# EAGLE design Lin_Termo (EAGLE 7.7.0)
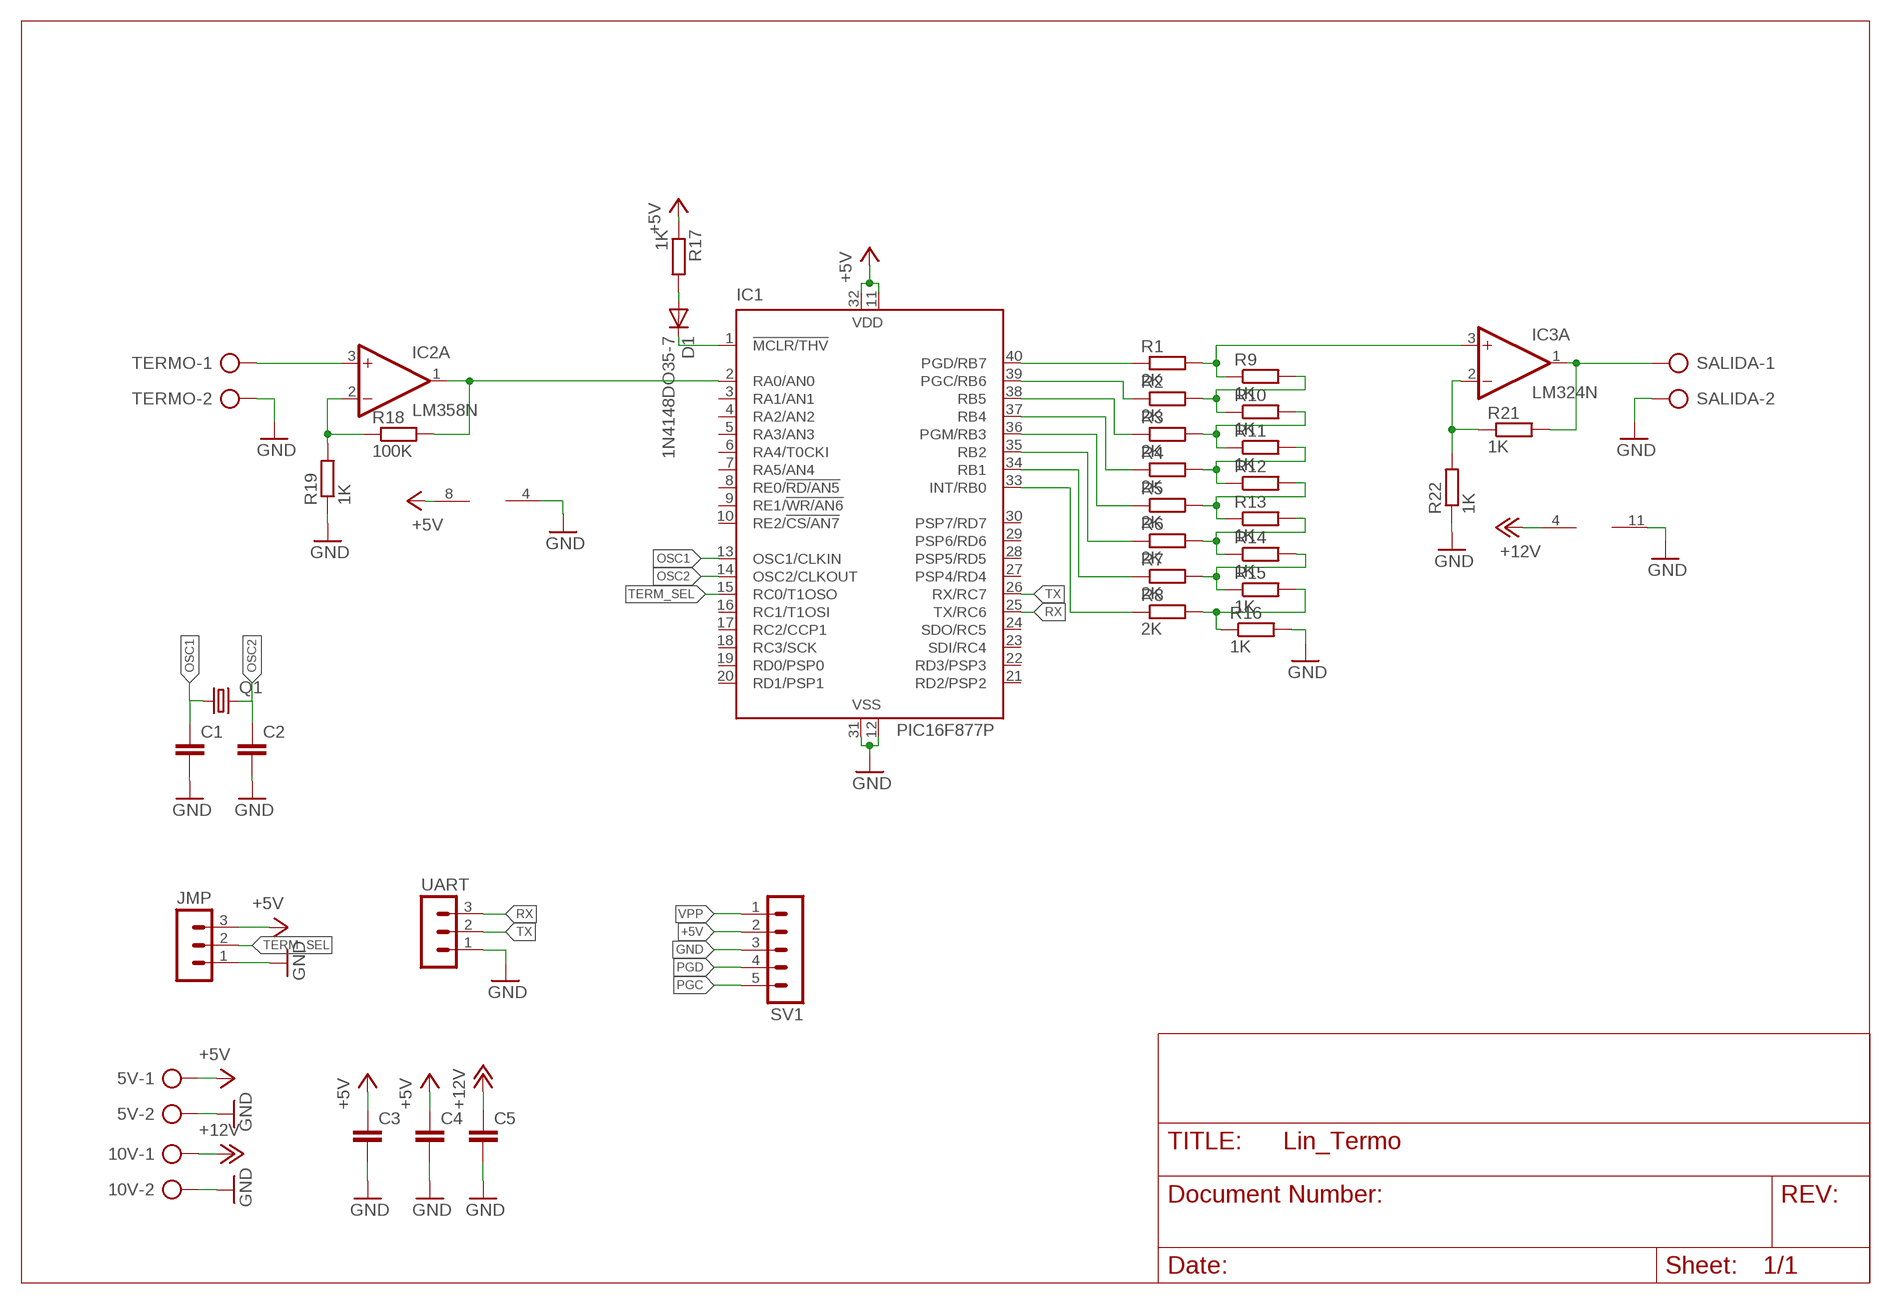
[diagram p0: schematic, sheet 1]

## Parts
5V  AK500/2  [AK500/2]
10V  AK500/2  [AK500/2]
C1  C-EU025-025X050  [C025-025X050]
C2  C-EU025-025X050  [C025-025X050]
C3  C-EU025-025X050  [C025-025X050]
C4  C-EU025-025X050  [C025-025X050]
C5  C-EU025-025X050  [C025-025X050]
D1  1N4148DO35-7  [DO35-7]
IC1  PIC16F877P  [DIL40]
IC2  LM358N  [DIL08]
IC3  LM324N  [DIL14]
JMP  MA03-1  [MA03-1]
Q1  CRYSTALHC49S  [HC49/S]
R1  2K  R-EU_0207/2V  [0207/2V]
R2  2K  R-EU_0207/2V  [0207/2V]
R3  2K  R-EU_0207/2V  [0207/2V]
R4  2K  R-EU_0207/2V  [0207/2V]
R5  2K  R-EU_0207/2V  [0207/2V]
R6  2K  R-EU_0207/2V  [0207/2V]
R7  2K  R-EU_0207/2V  [0207/2V]
R8  2K  R-EU_0207/2V  [0207/2V]
R9  1K  R-EU_0207/2V  [0207/2V]
R10  1K  R-EU_0207/2V  [0207/2V]
R11  1K  R-EU_0207/2V  [0207/2V]
R12  R-EU_0207/2V  [0207/2V]
R13  1K  R-EU_0207/2V  [0207/2V]
R14  1K  R-EU_0207/2V  [0207/2V]
R15  1K  R-EU_0207/2V  [0207/2V]
R16  1K  R-EU_0207/2V  [0207/2V]
R17  1K  R-EU_0207/7  [0207/7]
R18  100K  R-EU_0207/7  [0207/7]
R19  1K  R-EU_0207/7  [0207/7]
R21  1K  R-EU_0207/7  [0207/7]
R22  1K  R-EU_0207/7  [0207/7]
SALIDA  AK500/2  [AK500/2]
SV1  MA05-1  [MA05-1]
TERMO  AK500/2  [AK500/2]
UART  MA03-1  [MA03-1]

## Nets
+5V: 5V.1 C3.1 C4.1 IC1.11(VDD) IC1.32(VDD) IC2.8(P:V+) JMP.3 R17.1 SV1.2
+12V: 10V.1 C5.1 IC3.4(P:V+)
GND: 5V.2 10V.2 C1.2 C2.2 C3.2 C4.2 C5.2 IC1.12(VSS) IC1.31(VSS) IC2.4(P:V-) IC3.11(P:V-) JMP.1 R16.2 R19.1 R22.1 SALIDA.2 SV1.3 TERMO.2 UART.1
N$1: IC3.3(A:+IN) R1.2 R9.1
N$2: R2.2 R9.2 R10.1
N$3: R3.2 R10.2 R11.1
N$4: R4.2 R11.2 R12.1
N$5: R5.2 R12.2 R13.1
N$6: R6.2 R13.2 R14.1
N$7: R7.2 R14.2 R15.1
N$10: D1.A R17.2
N$12: IC1.38(RB5) R3.1
N$13: IC1.37(RB4) R4.1
N$14: IC1.36(PGM/RB3) R5.1
N$15: IC1.35(RB2) R6.1
N$16: IC1.34(RB1) R7.1
N$17: IC1.33(INT/RB0) R8.1
N$18: IC1.2(RA0/AN0) IC2.1(A:OUT) R18.2
N$20: IC2.2(A:-IN) R18.1 R19.2
N$21: IC2.3(A:+IN) TERMO.1
N$22: R8.2 R15.2 R16.1
N$26: IC3.2(A:-IN) R21.1 R22.2
N$27: IC3.1(A:OUT) R21.2 SALIDA.1
OSC1: C1.1 IC1.13(OSC1/CLKIN) Q1.1
OSC2: C2.1 IC1.14(OSC2/CLKOUT) Q1.2
PGC: IC1.39(PGC/RB6) R2.1 SV1.5
PGD: IC1.40(PGD/RB7) R1.1 SV1.4
RX: IC1.25(TX/RC6) UART.3
TERM_SEL: IC1.15(RC0/T1OSO) JMP.2
TX: IC1.26(RX/RC7) UART.2
VPP: D1.C IC1.1(!MCLR/THV) SV1.1
Unconnected: IC1.3(RA1/AN1) IC1.4(RA2/AN2) IC1.5(RA3/AN3) IC1.6(RA4/T0CKI) IC1.7(RA5/AN4) IC1.8(RE0/!RD/AN5) IC1.9(RE1/!WR/AN6) IC1.10(RE2/!CS/AN7) IC1.16(RC1/T1OSI) IC1.17(RC2/CCP1) IC1.18(RC3/SCK) IC1.19(RD0/PSP0) IC1.20(RD1/PSP1) IC1.21(RD2/PSP2) IC1.22(RD3/PSP3) IC1.23(SDI/RC4) IC1.24(SDO/RC5) IC1.27(PSP4/RD4) IC1.28(PSP5/RD5) IC1.29(PSP6/RD6) IC1.30(PSP7/RD7) IC2.5(B:+IN) IC2.6(B:-IN) IC2.7(B:OUT) IC3.5(B:+IN) IC3.6(B:-IN) IC3.7(B:OUT) IC3.8(C:OUT) IC3.9(C:-IN) IC3.10(C:+IN) IC3.12(D:+IN) IC3.13(D:-IN) IC3.14(D:OUT)

## Library data of the parts
5V 10V SALIDA TERMO = con-ptr500:AK500/2: CONNECTOR
C1-C5 = rcl:C-EU: CAPACITOR, European symbol
D1 = diode:1N4148: DIODE high speed (Philips)
IC1 = microchip:PIC16F87*: MICROCONTROLLER
IC2 = linear:LM358: OP AMP also LM158; LM258; LM2904 Source: http://cache.national.com/ds/LM/LM158.pdf
IC3 = linear:LM324: OP AMP
JMP UART = con-lstb:MA03-1: PIN HEADER
Q1 = crystal:CRYSTAL: CRYSTAL
R1-R19 R21 R22 = rcl:R-EU_: RESISTOR, European symbol
SV1 = con-lstb:MA05-1: PIN HEADER

## Board
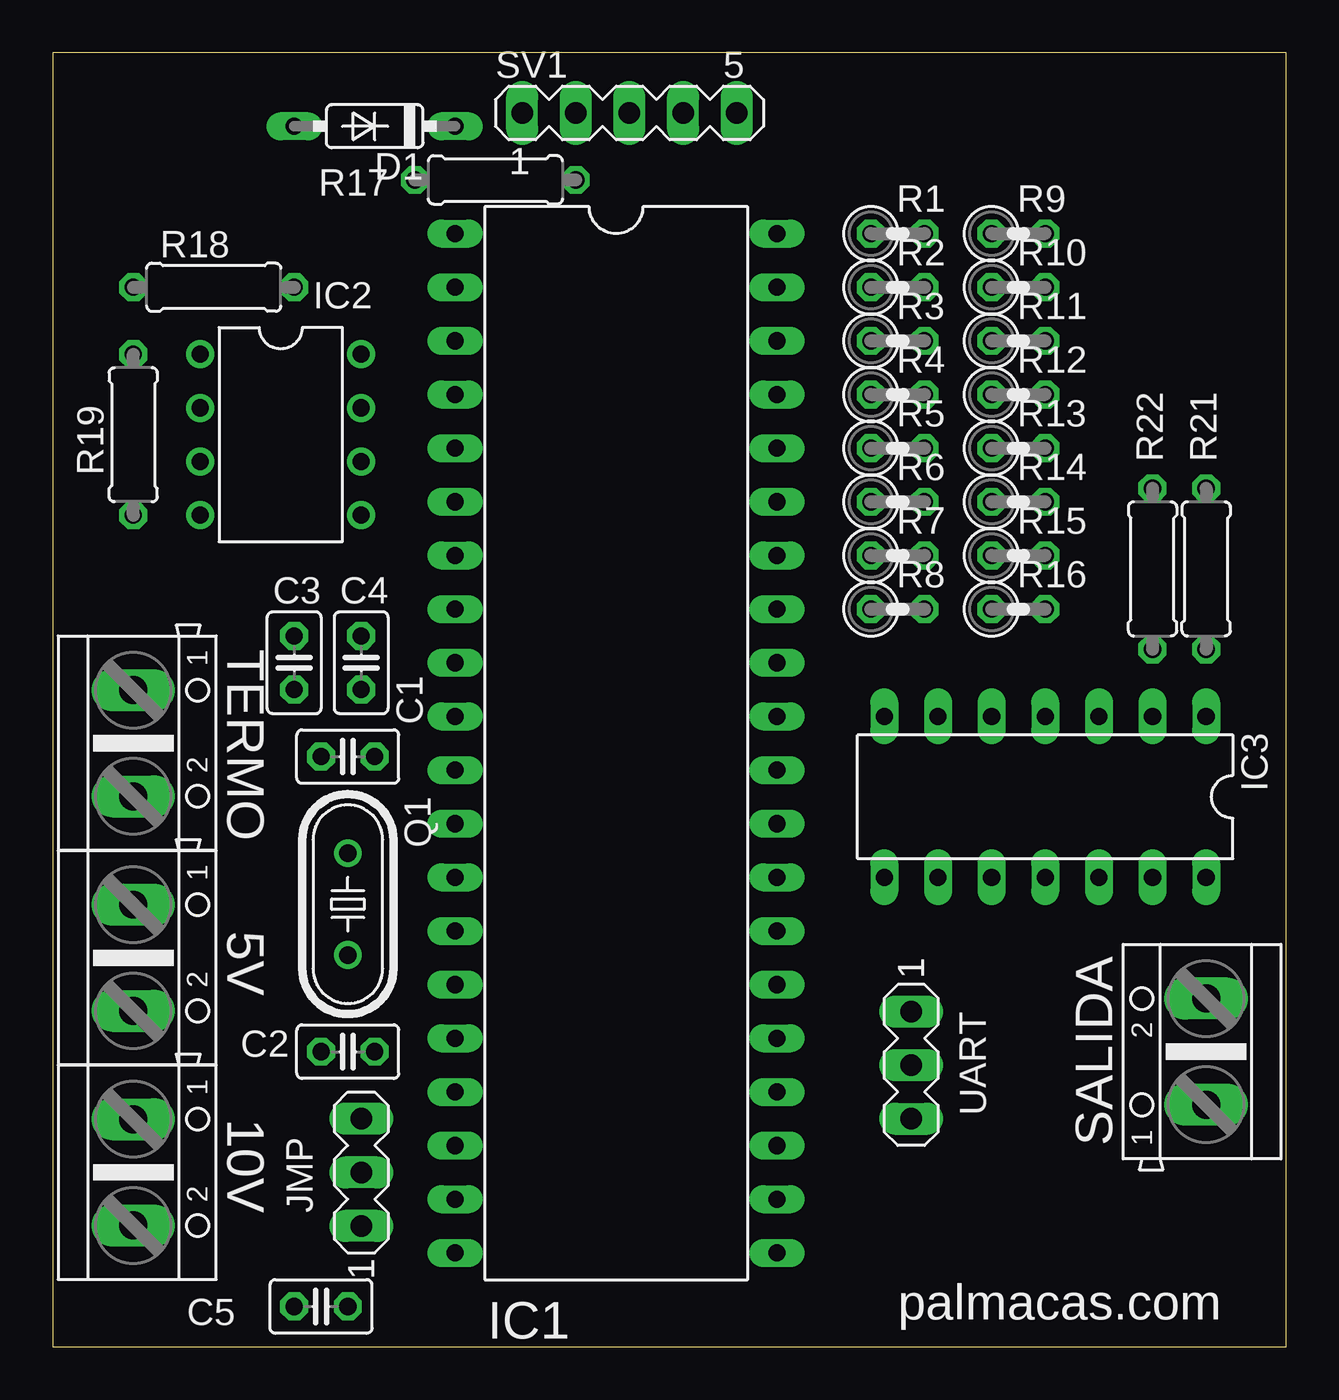
[diagram p1: board, top side]
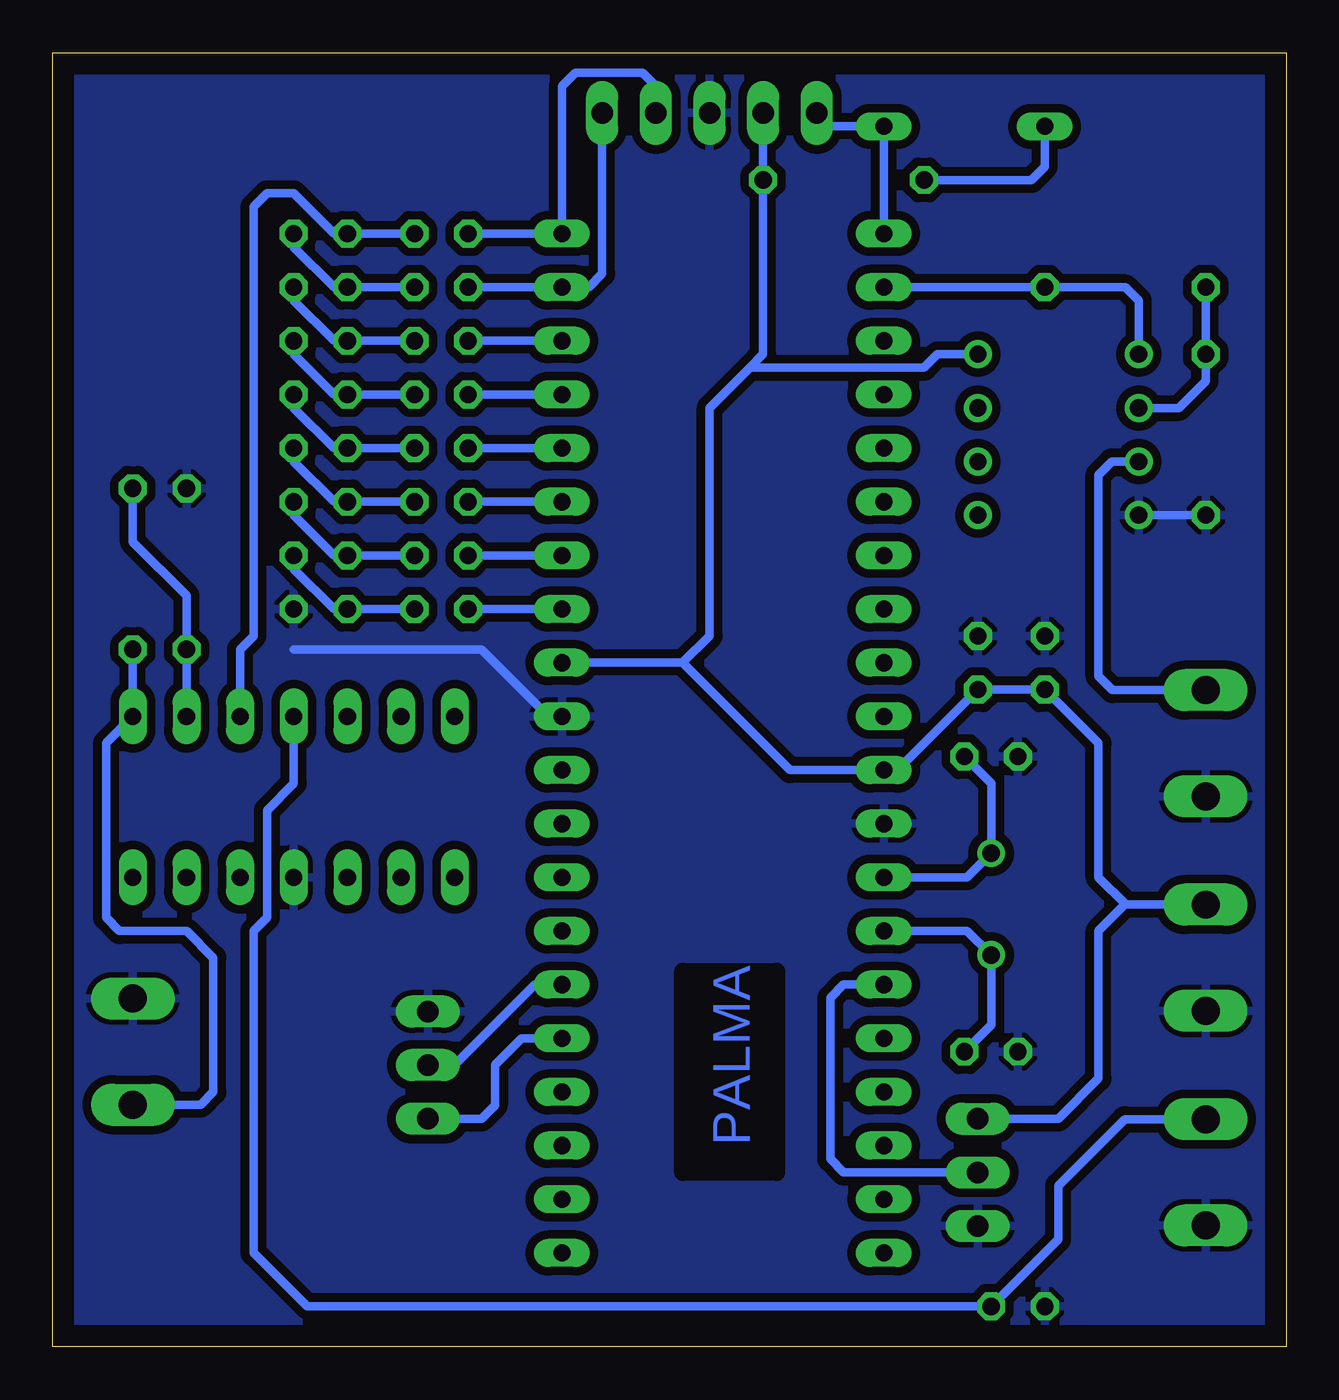
[diagram p2: board, bottom side, seen from below]

Size 58.4 x 61.27 mm. Coordinates in mm from the lower left corner, seen from the top.
Outline: 0,0 58.4,0 58.4,61.27 0,61.27 0,0
Copper layers (1*16): Top 0.035mm / dielectric 1.5mm / Bottom 0.035mm
Design rules "default": minimum track width 10mil, minimum drill 24mil, track to track 8mil, track to pad 8mil, pad to pad 8mil, via to via 8mil, smd to smd 8mil, copper to edge 40mil, drill to drill 8mil, minimum pad ring 10mil, minimum via ring 8mil, stop-mask expansion 4mil, vias tented up to drill 0mil, thermal gap 10mil
bRestrict: area 24.1,8.3 to 28.6,17.8

### Footprints (pad centres in the part's own frame; a part is rotated, then mirrored left to right if it is on the bottom)
AK500/2 = drill 1.321 long: 1 -2.515,0; 2 2.515,0
C025-025X050 = drill 0.813 octagon: 1 -1.27,0; 2 1.27,0
DO35-7 = drill 0.813 long: A 3.81,0; C -3.81,0
DIL40 = drill 0.813 long: 1 -24.13,-7.62; 2 -21.59,-7.62; 3 -19.05,-7.62; 4 -16.51,-7.62; 5 -13.97,-7.62; 6 -11.43,-7.62; 7 -8.89,-7.62; 8 -6.35,-7.62; 9 -3.81,-7.62; 10 -1.27,-7.62; 11 1.27,-7.62; 12 3.81,-7.62; 13 6.35,-7.62; 14 8.89,-7.62; 15 11.43,-7.62; 16 13.97,-7.62; 17 16.51,-7.62; 18 19.05,-7.62; 19 21.59,-7.62; 20 24.13,-7.62; 21 24.13,7.62; 22 21.59,7.62; 23 19.05,7.62; 24 16.51,7.62; 25 13.97,7.62; 26 11.43,7.62; 27 8.89,7.62; 28 6.35,7.62; 29 3.81,7.62; 30 1.27,7.62; 31 -1.27,7.62; 32 -3.81,7.62; 33 -6.35,7.62; 34 -8.89,7.62; 35 -11.43,7.62; 36 -13.97,7.62; 37 -16.51,7.62; 38 -19.05,7.62; 39 -21.59,7.62; 40 -24.13,7.62
DIL08 = drill 0.813 pad 1.27: 1 -3.81,-3.81; 2 -1.27,-3.81; 3 1.27,-3.81; 4 3.81,-3.81; 5 3.81,3.81; 6 1.27,3.81; 7 -1.27,3.81; 8 -3.81,3.81
DIL14 = drill 0.813 long: 1 -7.62,-3.81; 2 -5.08,-3.81; 3 -2.54,-3.81; 4 0,-3.81; 5 2.54,-3.81; 6 5.08,-3.81; 7 7.62,-3.81; 8 7.62,3.81; 9 5.08,3.81; 10 2.54,3.81; 11 0,3.81; 12 -2.54,3.81; 13 -5.08,3.81; 14 -7.62,3.81
MA03-1 = drill 1.016 long: 1 -2.54,0; 2 0,0; 3 2.54,0
HC49/S = drill 0.813: 1 -2.413,0; 2 2.413,0
0207/2V = drill 0.813 octagon: 1 -1.27,0; 2 1.27,0
0207/7 = drill 0.813 octagon: 1 -3.81,0; 2 3.81,0
MA05-1 = drill 1.016 long: 1 -5.08,0; 2 -2.54,0; 3 0,0; 4 2.54,0; 5 5.08,0

### Placement (x,y rotation side)
5V  3.81,18.41 270 top
10V  3.81,8.26 270 top
C1  13.97,27.94 180 top
C2  13.97,13.97 180 top
C3  11.43,32.38 90 top
C4  14.61,32.38 90 top
C5  12.7,1.91 180 top
D1  15.24,57.78 180 top
IC1  26.67,28.57 270 top
IC2  10.79,43.18 270 top
IC3  46.99,26.04 180 top
JMP  14.61,8.26 90 top
Q1  13.97,20.95 270 top
R1  40.01,52.7 0 top
R2  40.01,50.16 0 top
R3  40.01,47.62 0 top
R4  40.01,45.09 0 top
R5  40.01,42.55 0 top
R6  40.01,40.01 0 top
R7  40.01,37.47 0 top
R8  40.01,34.92 0 top
R9  45.72,52.7 0 top
R10  45.72,50.16 0 top
R11  45.72,47.62 0 top
R12  45.72,45.09 0 top
R13  45.72,42.55 0 top
R14  45.72,40.01 0 top
R15  45.72,37.47 0 top
R16  45.72,34.92 0 top
R17  20.95,55.24 180 top
R18  7.62,50.16 0 top
R19  3.81,43.18 90 top
R21  54.61,36.83 270 top
R22  52.07,36.83 270 top
SALIDA  54.61,13.97 90 top
SV1  27.3,58.42 0 top
TERMO  3.81,28.57 270 top
UART  40.64,13.34 270 top

### Tracks (layer width: path | path; a pad name or v marks a point on that pad's centre or on a via)
+5V
  Bottom 0.406: 28.57,32.38 23.5,27.3 IC1.11 18.41,27.3 C4.1 C3.1 8.89,28.57 8.89,22.23 7.59,20.93 | 28.57,32.38 IC1.32 | IC2.8 16.51,46.99 17.14,46.35 25.4,46.35 | 25.4,46.35 27.3,44.45 27.3,33.66 28.57,32.38 | 7.59,20.93 5V.1 | 7.59,20.93 7.64,20.93 8.89,19.68 8.89,12.7 10.79,10.79 JMP.3 | 25.4,46.35 24.77,46.99 R17.1 SV1.2
+12V
  Bottom 0.406: 10V.1 7.64,10.77 10.79,7.62 10.79,5.08 C5.1 46.35,1.91 48.9,4.45 48.9,19.68 48.26,20.32 48.26,25.4 46.99,26.67 IC3.4
GND
  Bottom 0.406: R19.1 IC2.4 | IC1.31 34.92,29.84 38.1,33.02 46.99,33.02
  pour Bottom (isolate 0.406): 0,0 58.42,0 58.42,60.96 0,60.96
N$1
  Bottom 0.406: R1.2 R9.1 45.09,52.7 46.99,54.61 48.26,54.61 48.9,53.98 48.9,33.66 49.53,33.02 IC3.3
N$2
  Bottom 0.406: R2.2 R10.1 45.09,50.16 46.99,52.07 R9.2
N$3
  Bottom 0.406: R3.2 R11.1 45.09,47.62 46.99,49.53 R10.2
N$4
  Bottom 0.406: R4.2 R12.1 45.09,45.09 46.99,46.99 R11.2
N$5
  Bottom 0.406: R5.2 R13.1 45.09,42.55 46.99,44.45 R12.2
N$6
  Bottom 0.406: R6.2 R14.1 45.09,40.01 46.99,41.91 R13.2
N$7
  Bottom 0.406: R7.2 R15.1 45.09,37.47 46.99,39.37 R14.2
N$10
  Bottom 0.406: D1.A 11.43,55.88 12.06,55.24 R17.2
N$12
  Bottom 0.406: IC1.38 R3.1
N$13
  Bottom 0.406: IC1.37 R4.1
N$14
  Bottom 0.406: IC1.36 R5.1
N$15
  Bottom 0.406: IC1.35 R6.1
N$16
  Bottom 0.406: IC1.34 R7.1
N$17
  Bottom 0.406: IC1.33 R8.1
N$18
  Bottom 0.406: IC2.1 6.99,49.53 7.62,50.16 R18.2 IC1.2
N$20
  Bottom 0.406: R18.1 R19.2 3.81,45.72 5.08,44.45 IC2.2
N$21
  Bottom 0.406: TERMO.1 8.23,31.09 8.89,31.75 8.89,41.27 8.26,41.91 IC2.3
N$22
  Bottom 0.406: R8.2 R16.1 45.09,34.92 46.99,36.83 R15.2
N$26
  Bottom 0.406: IC3.2 R22.2 52.07,35.56 54.61,38.1 R21.1
N$27
  Bottom 0.406: R21.2 IC3.1 55.88,28.57 55.88,20.32 55.24,19.68 52.07,19.68 50.8,18.41 50.8,12.06 51.41,11.46 SALIDA.1
OSC1
  Bottom 0.406: IC1.13 15.11,22.23 Q1.1 13.97,26.67 C1.1
OSC2
  Bottom 0.406: IC1.14 15.11,19.68 Q1.2 13.97,15.24 C2.1
PGC
  Bottom 0.406: R2.1 IC1.39 33.02,50.16 32.38,50.8 SV1.5
PGD
  Bottom 0.406: R1.1 IC1.40 34.29,59.69 33.66,60.33 30.48,60.33 29.84,59.69 SV1.4
RX
  Bottom 0.406: IC1.25 36.2,14.61 37.47,13.34 37.47,11.43 38.1,10.79 UART.3
TERM_SEL
  Bottom 0.406: JMP.2 20.95,8.26 21.59,8.89 21.59,16.51 20.95,17.14 IC1.15
TX
  Bottom 0.406: IC1.26 35.56,17.14 39.37,13.34 UART.2
VPP
  Bottom 0.406: IC1.1 D1.C 21.59,57.78 SV1.1

### Text on the board
Bottom: PALMA
tPlace: palmacas.com